# Altium project HBridge.PrjPcb
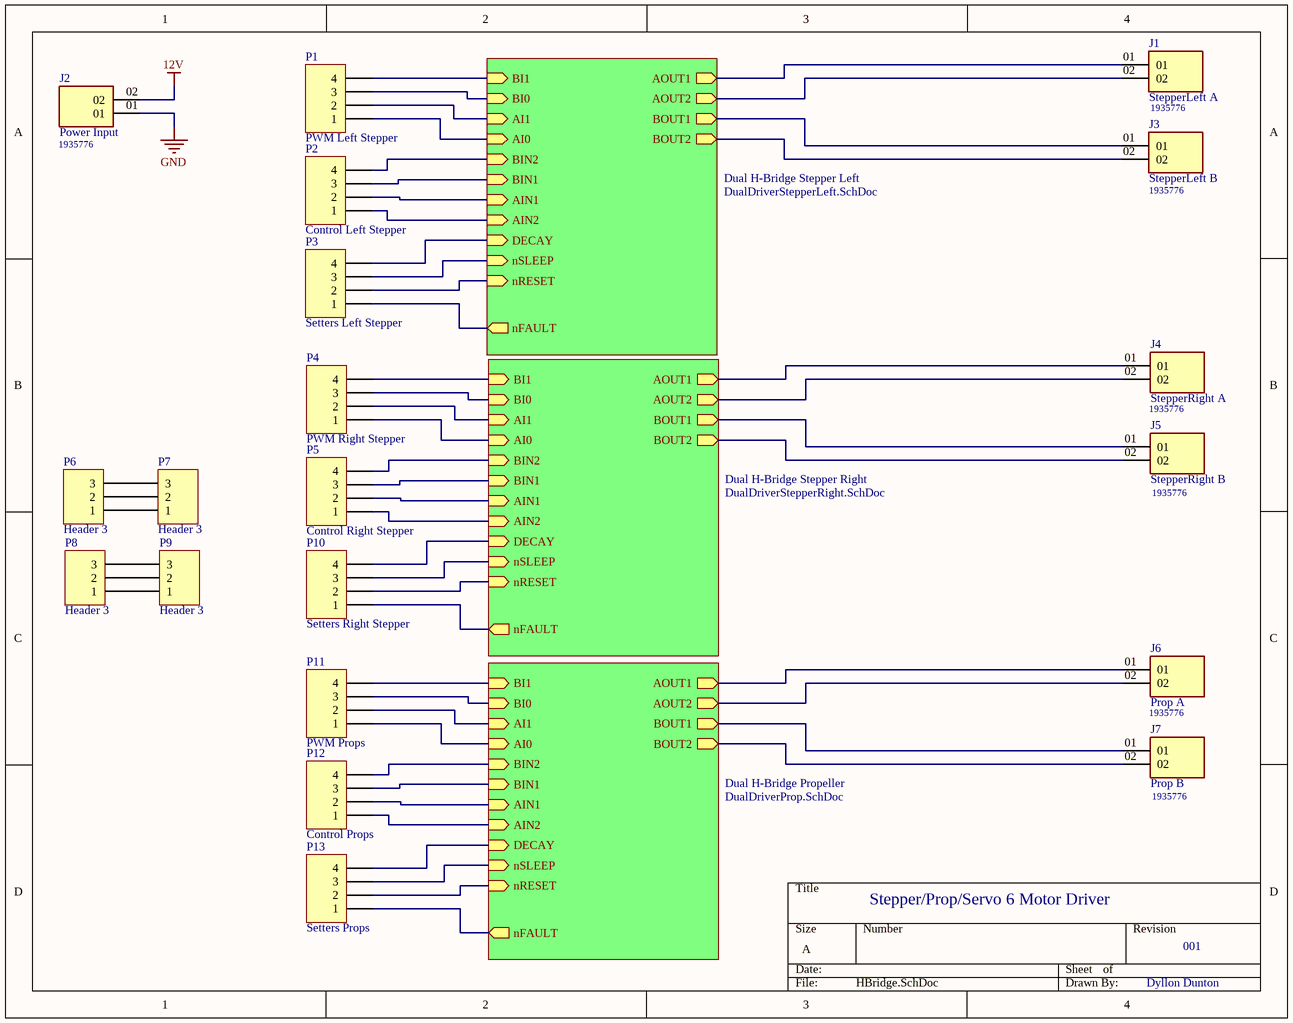
[diagram p0: HBridge.SchDoc]
3 sheets, 40 parts. Net scope: hierarchical (ports join the sheet entries above them; power ports are global).
Board file: HBridge.PcbDoc
Sheets:
  HBridge.SchDoc
    Dual H-Bridge Stepper Left = DualDriverStepperLeft.SchDoc
    Dual H-Bridge Propeller = DualDriverProp.SchDoc

## Sheet HBridge.SchDoc
size A

### Parts
J1  StepperLeft A  [PHOENIX_1935776]
J2  Power Input  [PHOENIX_1935776]
J3  StepperLeft B  [PHOENIX_1935776]
J4  StepperRight A  [PHOENIX_1935776]
J5  StepperRight B  [PHOENIX_1935776]
J6  Prop A  [PHOENIX_1935776]
J7  Prop B  [PHOENIX_1935776]
P1  PWM Left Stepper  [HDR1X4]
P2  Control Left Stepper  [HDR1X4]
P3  Setters Left Stepper  [HDR1X4]
P4  PWM Right Stepper  [HDR1X4]
P5  Control Right Stepper  [HDR1X4]
P6  Header 3  [HDR1X3]
P7  Header 3  [HDR1X3]
P8  Header 3  [HDR1X3]
P9  Header 3  [HDR1X3]
P10  Setters Right Stepper  [HDR1X4]
P11  PWM Props  [HDR1X4]
P12  Control Props  [HDR1X4]
P13  Setters Props  [HDR1X4]

### Sub-sheets
Dual H-Bridge Propeller = DualDriverProp.SchDoc: BI1 (in), BI0 (in), AI1 (in), AI0 (in), BIN2 (in), BIN1 (in), AIN1 (in), AIN2 (in), DECAY (in), nSLEEP (in), nRESET (in), nFAULT (out), AOUT1 (out), AOUT2 (out), BOUT1 (out), BOUT2 (out)
Dual H-Bridge Stepper Left = DualDriverStepperLeft.SchDoc: BI1 (in), BI0 (in), AI1 (in), AI0 (in), BIN2 (in), BIN1 (in), AIN1 (in), AIN2 (in), DECAY (in), nSLEEP (in), nRESET (in), nFAULT (out), AOUT1 (out), AOUT2 (out), BOUT1 (out), BOUT2 (out)
Dual H-Bridge Stepper Right = DualDriverStepperRight.SchDoc (file not in this document): BI1 (in), BI0 (in), AI1 (in), AI0 (in), BIN2 (in), BIN1 (in), AIN1 (in), AIN2 (in), DECAY (in), nSLEEP (in), nRESET (in), nFAULT (out), AOUT1 (out), AOUT2 (out), BOUT1 (out), BOUT2 (out)

### Nets
12V: J2.02
GND: J2.01
NetJ1_01: J1.01 ; sheet Dual H-Bridge Stepper Left/AOUT1
NetJ1_02: J1.02 ; sheet Dual H-Bridge Stepper Left/AOUT2
NetJ3_01: J3.01 ; sheet Dual H-Bridge Stepper Left/BOUT1
NetJ3_02: J3.02 ; sheet Dual H-Bridge Stepper Left/BOUT2
NetJ4_01: J4.01 ; sheet Dual H-Bridge Stepper Right/AOUT1
NetJ4_02: J4.02 ; sheet Dual H-Bridge Stepper Right/AOUT2
NetJ5_01: J5.01 ; sheet Dual H-Bridge Stepper Right/BOUT1
NetJ5_02: J5.02 ; sheet Dual H-Bridge Stepper Right/BOUT2
NetJ6_01: J6.01 ; sheet Dual H-Bridge Propeller/AOUT1
NetJ6_02: J6.02 ; sheet Dual H-Bridge Propeller/AOUT2
NetJ7_01: J7.01 ; sheet Dual H-Bridge Propeller/BOUT1
NetJ7_02: J7.02 ; sheet Dual H-Bridge Propeller/BOUT2
NetP1_1: P1.1 ; sheet Dual H-Bridge Stepper Left/AI0
NetP1_2: P1.2 ; sheet Dual H-Bridge Stepper Left/AI1
NetP1_3: P1.3 ; sheet Dual H-Bridge Stepper Left/BI0
NetP1_4: P1.4 ; sheet Dual H-Bridge Stepper Left/BI1
NetP2_1: P2.1 ; sheet Dual H-Bridge Stepper Left/AIN2
NetP2_2: P2.2 ; sheet Dual H-Bridge Stepper Left/AIN1
NetP2_3: P2.3 ; sheet Dual H-Bridge Stepper Left/BIN1
NetP2_4: P2.4 ; sheet Dual H-Bridge Stepper Left/BIN2
NetP3_1: P3.1 ; sheet Dual H-Bridge Stepper Left/nFAULT
NetP3_2: P3.2 ; sheet Dual H-Bridge Stepper Left/nRESET
NetP3_3: P3.3 ; sheet Dual H-Bridge Stepper Left/nSLEEP
NetP3_4: P3.4 ; sheet Dual H-Bridge Stepper Left/DECAY
NetP4_1: P4.1 ; sheet Dual H-Bridge Stepper Right/AI0
NetP4_2: P4.2 ; sheet Dual H-Bridge Stepper Right/AI1
NetP4_3: P4.3 ; sheet Dual H-Bridge Stepper Right/BI0
NetP4_4: P4.4 ; sheet Dual H-Bridge Stepper Right/BI1
NetP5_1: P5.1 ; sheet Dual H-Bridge Stepper Right/AIN2
NetP5_2: P5.2 ; sheet Dual H-Bridge Stepper Right/AIN1
NetP5_3: P5.3 ; sheet Dual H-Bridge Stepper Right/BIN1
NetP5_4: P5.4 ; sheet Dual H-Bridge Stepper Right/BIN2
NetP6_1: P6.1 P7.1
NetP6_2: P6.2 P7.2
NetP6_3: P6.3 P7.3
NetP8_1: P8.1 P9.1
NetP8_2: P8.2 P9.2
NetP8_3: P8.3 P9.3
NetP10_1: P10.1 ; sheet Dual H-Bridge Stepper Right/nFAULT
NetP10_2: P10.2 ; sheet Dual H-Bridge Stepper Right/nRESET
NetP10_3: P10.3 ; sheet Dual H-Bridge Stepper Right/nSLEEP
NetP10_4: P10.4 ; sheet Dual H-Bridge Stepper Right/DECAY
NetP11_1: P11.1 ; sheet Dual H-Bridge Propeller/AI0
NetP11_2: P11.2 ; sheet Dual H-Bridge Propeller/AI1
NetP11_3: P11.3 ; sheet Dual H-Bridge Propeller/BI0
NetP11_4: P11.4 ; sheet Dual H-Bridge Propeller/BI1
NetP12_1: P12.1 ; sheet Dual H-Bridge Propeller/AIN2
NetP12_2: P12.2 ; sheet Dual H-Bridge Propeller/AIN1
NetP12_3: P12.3 ; sheet Dual H-Bridge Propeller/BIN1
NetP12_4: P12.4 ; sheet Dual H-Bridge Propeller/BIN2
NetP13_1: P13.1 ; sheet Dual H-Bridge Propeller/nFAULT
NetP13_2: P13.2 ; sheet Dual H-Bridge Propeller/nRESET
NetP13_3: P13.3 ; sheet Dual H-Bridge Propeller/nSLEEP
NetP13_4: P13.4 ; sheet Dual H-Bridge Propeller/DECAY

### Notes on the sheet
- (near J2) 1935776
- 1935776
- (near J3) 1935776
- (near J5) 1935776
- (near J7) 1935776
- Stepper/Prop/Servo 6 Motor Driver
- 001
- Dyllon Dunton

### Library data of the parts
J1-J7 = 1935776: Package: None; MP: 1935776; Availability: Unavailable; Price: None; Value: *
P1-P5 P10-P13 = Header 4: Header, 4-Pin; LatestRevisionDate: 17-Jul-2002; LatestRevisionNote: Re-released for DXP Platform.; Publisher: Altium Limited
P6-P9 = Header 3: Header, 3-Pin; LatestRevisionDate: 17-Jul-2002; LatestRevisionNote: Re-released for DXP Platform.; Publisher: Altium Limited

## Sheet DualDriverStepperLeft.SchDoc
size A
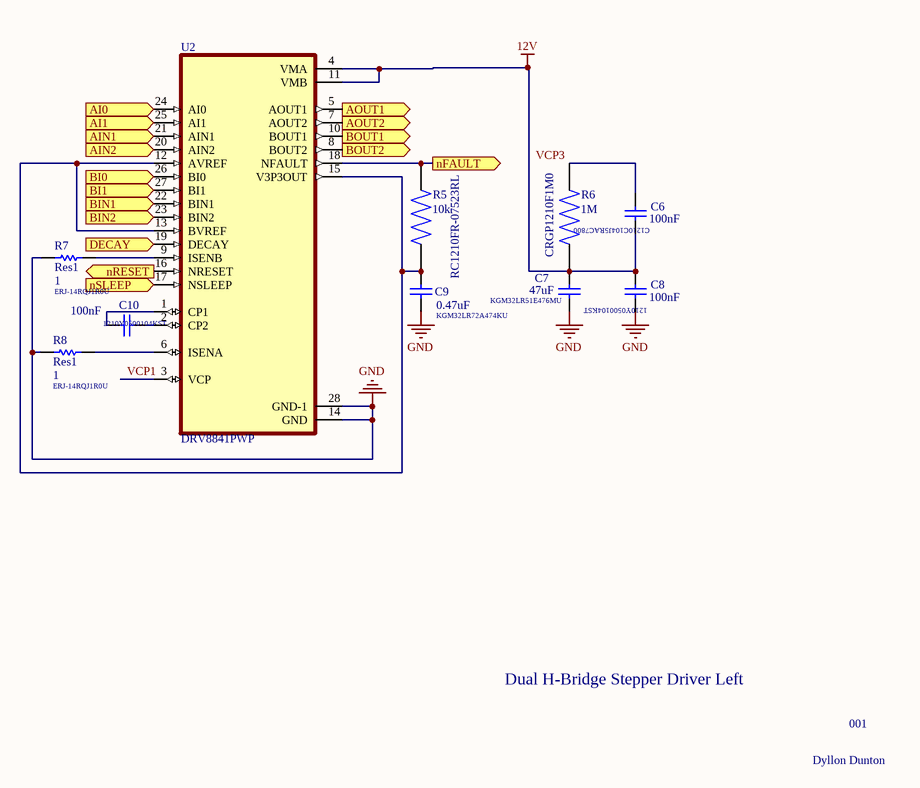
[diagram p1: DualDriverStepperLeft.SchDoc]

### Parts
C6  value 100nF  [C1210]  (hidden comment: Cap)
C7  value 47uF  [C1210]  (hidden comment: Cap)
C8  value 100nF  [C1210]  (hidden comment: Cap)
C9  value 0.47uF  [C1210]  (hidden comment: Cap)
C10  value 100nF  [C1210]  (hidden comment: Cap)
R5  RC1210FR-07523RL  value 10k  [RESC3126X65N]
R6  CRGP1210F1M0  value 1M  [RESC3126X65N]
R7  Res1  value 1  [RES_ERJ14RQJ1R0U]
R8  Res1  value 1  [RES_ERJ14RQJ1R0U]
U2  DRV8841PWP  [IC_TPS61196PWPRQ1]

### Ports
AI0 (in), AI1 (in), AIN1 (in), AIN2 (in), AOUT1 (out), AOUT2 (out), BI0 (in), BI1 (in), BIN1 (in), BIN2 (in), BOUT1 (out), BOUT2 (out), DECAY (in), nFAULT (out), nRESET (in), nSLEEP (in)

### Nets
12V: C6.2 C7.2 C8.1 R6.1 U2.4(VMA) U2.11(VMB)
GND: C7.1 C8.2 C9.1 R7.1 R8.1 U2.14(GND) U2.28(GND-1)
VCP1: U2.3(VCP)
NetC6_1: C6.1 R6.2
NetC9_2: C9.2 R5.1 U2.12(AVREF) U2.13(BVREF) U2.15(V3P3OUT)
NetC10_1: C10.1 U2.2(CP2)
NetC10_2: C10.2 U2.1(CP1)
NetJ1_01: U2.5(AOUT1) ; port AOUT1
NetJ1_02: U2.7(AOUT2) ; port AOUT2
NetJ3_01: U2.10(BOUT1) ; port BOUT1
NetJ3_02: U2.8(BOUT2) ; port BOUT2
NetP1_1: U2.24(AI0) ; port AI0
NetP1_2: U2.25(AI1) ; port AI1
NetP1_3: U2.26(BI0) ; port BI0
NetP1_4: U2.27(BI1) ; port BI1
NetP2_1: U2.20(AIN2) ; port AIN2
NetP2_2: U2.21(AIN1) ; port AIN1
NetP2_3: U2.22(BIN1) ; port BIN1
NetP2_4: U2.23(BIN2) ; port BIN2
NetP3_1: R5.2 U2.18(NFAULT) ; port nFAULT
NetP3_2: U2.16(NRESET) ; port nRESET
NetP3_3: U2.17(NSLEEP) ; port nSLEEP
NetP3_4: U2.19(DECAY) ; port DECAY
NetR7_2: R7.2 U2.9(ISENB)
NetR8_2: R8.2 U2.6(ISENA)

### Notes on the sheet
- (near C6) C1210C104J5RAC7800
- ERJ-14RQJ1R0U
- 1210Y0500104KST
- (near C9) KGM32LR72A474KU
- (near C7) KGM32LR51E476MU
- (near C8) 1210Y0500104KST
- (near R8) ERJ-14RQJ1R0U
- Dual H-Bridge Stepper Driver Left
- 001
- Dyllon Dunton
- Labels drawn without touching a wire or pin: VCP3

### Library data of the parts
C6-C10 = Cap: Capacitor; Published: 8-Jun-2000; LatestRevisionDate: 17-Jul-2002; LatestRevisionNote: Re-released for DXP Platform.; PackageReference: RAD-0.3; Publisher: Altium Limited; PackageDescription: Radial Cap, Thru-Hole; 2 Leads; 0.3 in Pin Spacing
R5 R6 = RC1210FR-07523RL: 523 Ohms Â±1% 0.5W, 1/2W Chip Resistor 1210 _3225 Metric_ Moisture Resistant Thick Film; MF: Yageo; Package: 3126 Yageo; Availability: Unavailable; MP: RC1210FR-07523RL; SnapEDA_Link: https://www.snapeda.com/parts/RC1210FR-07523RL/Yageo/view-part/1091979/?ref=snap; Price: None
R7 R8 = Res1: Resistor; Published: 8-Jun-2000; LatestRevisionDate: 17-Jul-2002; LatestRevisionNote: Re-released for DXP Platform.; PackageReference: AXIAL-0.3; Publisher: Altium Limited; PackageDescription: Axial Device, Thru-Hole; 2 Leads; 0.3 in Pin Spacing
U2 = DRV8841PWP: 45-V, 2.5-A bipolar stepper or dual H-bridge motor driver IC with current regulation and PWM control; MF: Texas Instruments; Value: *; SnapEDA_Link: https://www.snapeda.com/parts/DRV8841PWP/Texas+Instruments/view-part/?ref=snap; Check_prices: https://www.snapeda.com/parts/DRV8841PWP/Texas+Instruments/view-part/?ref=eda; Purchase-URL: https://pricing.snapeda.com/search/part/DRV8841PWP/?ref=eda; Availability: In Stock; Price: None; Package: HTSSOP-28 Texas Instruments; MP: DRV8841PWP

## Sheet DualDriverProp.SchDoc
size A
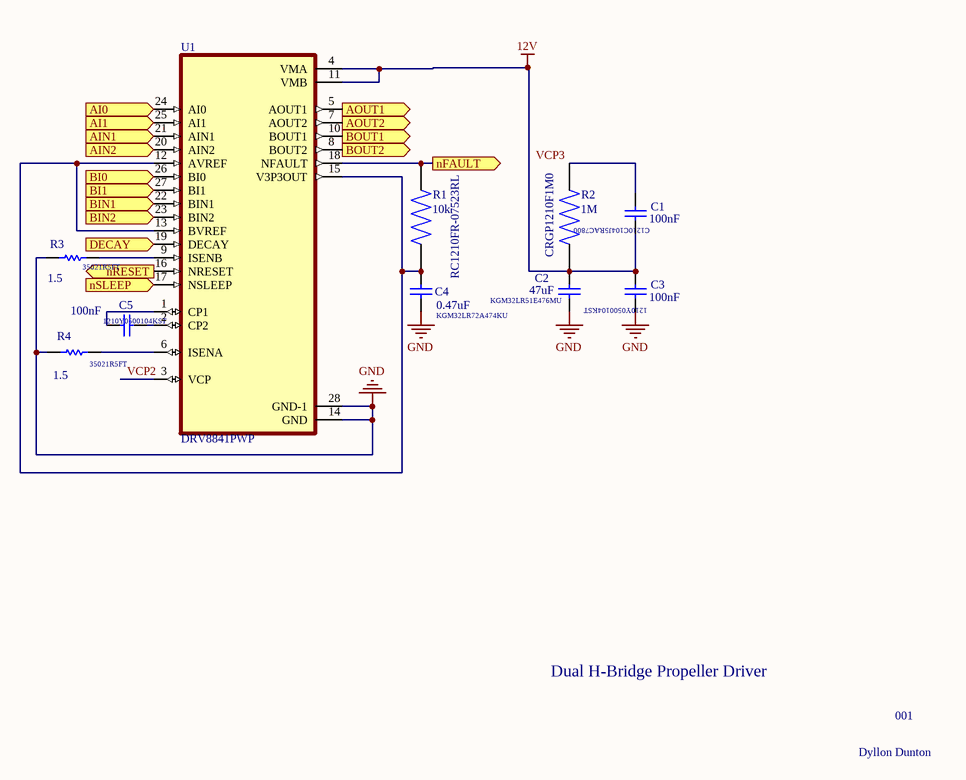
[diagram p2: DualDriverProp.SchDoc]

### Parts
C1  value 100nF  [C1210]  (hidden comment: Cap)
C2  value 47uF  [C1210]  (hidden comment: Cap)
C3  value 100nF  [C1210]  (hidden comment: Cap)
C4  value 0.47uF  [C1210]  (hidden comment: Cap)
C5  value 100nF  [C1210]  (hidden comment: Cap)
R1  RC1210FR-07523RL  value 10k  [RESC3126X65N]
R2  CRGP1210F1M0  value 1M  [RESC3126X65N]
R3  value 1.5  [RESC5025X70N]  (hidden comment: Res1)
R4  value 1.5  [RESC5025X70N]  (hidden comment: Res1)
U1  DRV8841PWP  [IC_TPS61196PWPRQ1]

### Ports
AI0 (in), AI1 (in), AIN1 (in), AIN2 (in), AOUT1 (out), AOUT2 (out), BI0 (in), BI1 (in), BIN1 (in), BIN2 (in), BOUT1 (out), BOUT2 (out), DECAY (in), nFAULT (out), nRESET (in), nSLEEP (in)

### Nets
12V: C1.2 C2.2 C3.1 R2.1 U1.4(VMA) U1.11(VMB)
GND: C2.1 C3.2 C4.1 R3.1 R4.1 U1.14(GND) U1.28(GND-1)
VCP2: U1.3(VCP)
NetC1_1: C1.1 R2.2
NetC4_2: C4.2 R1.1 U1.12(AVREF) U1.13(BVREF) U1.15(V3P3OUT)
NetC5_1: C5.1 U1.2(CP2)
NetC5_2: C5.2 U1.1(CP1)
NetJ6_01: U1.5(AOUT1) ; port AOUT1
NetJ6_02: U1.7(AOUT2) ; port AOUT2
NetJ7_01: U1.10(BOUT1) ; port BOUT1
NetJ7_02: U1.8(BOUT2) ; port BOUT2
NetP11_1: U1.24(AI0) ; port AI0
NetP11_2: U1.25(AI1) ; port AI1
NetP11_3: U1.26(BI0) ; port BI0
NetP11_4: U1.27(BI1) ; port BI1
NetP12_1: U1.20(AIN2) ; port AIN2
NetP12_2: U1.21(AIN1) ; port AIN1
NetP12_3: U1.22(BIN1) ; port BIN1
NetP12_4: U1.23(BIN2) ; port BIN2
NetP13_1: R1.2 U1.18(NFAULT) ; port nFAULT
NetP13_2: U1.16(NRESET) ; port nRESET
NetP13_3: U1.17(NSLEEP) ; port nSLEEP
NetP13_4: U1.19(DECAY) ; port DECAY
NetR3_2: R3.2 U1.9(ISENB)
NetR4_2: R4.2 U1.6(ISENA)

### Notes on the sheet
- (near R3) 35021R5FT
- (near C1) C1210C104J5RAC7800
- 1210Y0500104KST
- (near C4) KGM32LR72A474KU
- (near C2) KGM32LR51E476MU
- (near C3) 1210Y0500104KST
- (near R4) 35021R5FT
- Dual H-Bridge Propeller Driver
- 001
- Dyllon Dunton
- Labels drawn without touching a wire or pin: VCP3

### Library data of the parts
C1-C5 = Cap: Capacitor; Published: 8-Jun-2000; LatestRevisionDate: 17-Jul-2002; LatestRevisionNote: Re-released for DXP Platform.; PackageReference: RAD-0.3; Publisher: Altium Limited; PackageDescription: Radial Cap, Thru-Hole; 2 Leads; 0.3 in Pin Spacing
R1 R2 = RC1210FR-07523RL: as R5 on sheet DualDriverStepperLeft; Package: 3126 Yageo; Availability: Unavailable; MP: RC1210FR-07523RL; SnapEDA_Link: https://www.snapeda.com/parts/RC1210FR-07523RL/Yageo/view-part/1091979/?ref=snap; Price: None
R3 R4 = Res1: Resistor; Published: 8-Jun-2000; LatestRevisionDate: 17-Jul-2002; LatestRevisionNote: Re-released for DXP Platform.; PackageReference: AXIAL-0.3; Publisher: Altium Limited; PackageDescription: Axial Device, Thru-Hole; 2 Leads; 0.3 in Pin Spacing
U1 = DRV8841PWP: as U2 on sheet DualDriverStepperLeft; Value: *; SnapEDA_Link: https://www.snapeda.com/parts/DRV8841PWP/Texas+Instruments/view-part/?ref=snap; Check_prices: https://www.snapeda.com/parts/DRV8841PWP/Texas+Instruments/view-part/?ref=eda; Purchase-URL: https://pricing.snapeda.com/search/part/DRV8841PWP/?ref=eda; Availability: In Stock; Price: None; Package: HTSSOP-28 Texas Instruments; MP: DRV8841PWP

## Nets that join several sheets
12V: HBridge (J2.02), DualDriverStepperLeft (6 pins), DualDriverProp (6 pins)
GND: HBridge (J2.01), DualDriverStepperLeft (7 pins), DualDriverProp (7 pins)
NetJ1_01: HBridge (J1.01), DualDriverStepperLeft (U2.5)
NetJ1_02: HBridge (J1.02), DualDriverStepperLeft (U2.7)
NetJ3_01: HBridge (J3.01), DualDriverStepperLeft (U2.10)
NetJ3_02: HBridge (J3.02), DualDriverStepperLeft (U2.8)
NetJ6_01: HBridge (J6.01), DualDriverProp (U1.5)
NetJ6_02: HBridge (J6.02), DualDriverProp (U1.7)
NetJ7_01: HBridge (J7.01), DualDriverProp (U1.10)
NetJ7_02: HBridge (J7.02), DualDriverProp (U1.8)
NetP1_1: HBridge (P1.1), DualDriverStepperLeft (U2.24)
NetP1_2: HBridge (P1.2), DualDriverStepperLeft (U2.25)
NetP1_3: HBridge (P1.3), DualDriverStepperLeft (U2.26)
NetP1_4: HBridge (P1.4), DualDriverStepperLeft (U2.27)
NetP2_1: HBridge (P2.1), DualDriverStepperLeft (U2.20)
NetP2_2: HBridge (P2.2), DualDriverStepperLeft (U2.21)
NetP2_3: HBridge (P2.3), DualDriverStepperLeft (U2.22)
NetP2_4: HBridge (P2.4), DualDriverStepperLeft (U2.23)
NetP3_1: HBridge (P3.1), DualDriverStepperLeft (R5.2 U2.18)
NetP3_2: HBridge (P3.2), DualDriverStepperLeft (U2.16)
NetP3_3: HBridge (P3.3), DualDriverStepperLeft (U2.17)
NetP3_4: HBridge (P3.4), DualDriverStepperLeft (U2.19)
NetP11_1: HBridge (P11.1), DualDriverProp (U1.24)
NetP11_2: HBridge (P11.2), DualDriverProp (U1.25)
NetP11_3: HBridge (P11.3), DualDriverProp (U1.26)
NetP11_4: HBridge (P11.4), DualDriverProp (U1.27)
NetP12_1: HBridge (P12.1), DualDriverProp (U1.20)
NetP12_2: HBridge (P12.2), DualDriverProp (U1.21)
NetP12_3: HBridge (P12.3), DualDriverProp (U1.22)
NetP12_4: HBridge (P12.4), DualDriverProp (U1.23)
NetP13_1: HBridge (P13.1), DualDriverProp (R1.2 U1.18)
NetP13_2: HBridge (P13.2), DualDriverProp (U1.16)
NetP13_3: HBridge (P13.3), DualDriverProp (U1.17)
NetP13_4: HBridge (P13.4), DualDriverProp (U1.19)